# Altium project 12-5.PrjPcb
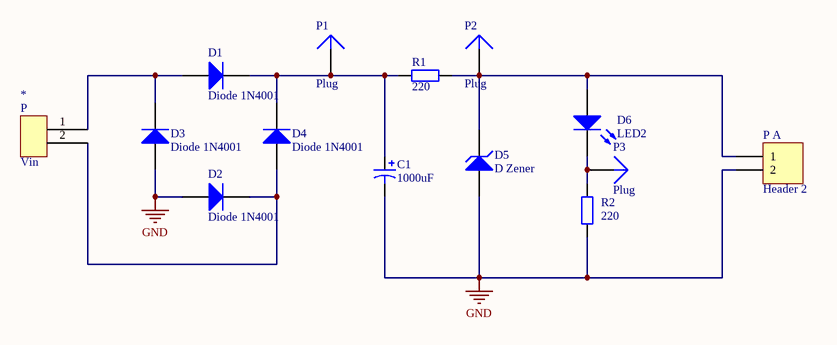
[diagram p0: 12to5.SchDoc]
1 sheet, 14 parts. Net scope: global (net labels, ports and power ports of the same name join across sheets).
Board file: 12to5IR.PcbDoc

## Sheet 12to5.SchDoc
size A; SheetNumber: 1; SheetTotal: 1; SPICEModelCacheKKYJQCPS: <root> / <DocumentId>KKYJQCPS</DocumentId> / <CacheFrame Number="0"> / <Model Name="1n4001" Kind="MDL"> / <Text>*1N4001 MCE 8-16-95 / *50V 1A Si GenPurpose Diode pkg:DIODE0.4 1,2 / .MODEL 1N4001 D(IS=2.55E-9 RS=0.042 N=1.75 TT=5.76E-6 CJO=1.85E-11 / + VJ=0.75 M=0.333 BV=50 IBV=1E-5 )</Text> / </Model> / <Model Name="led2" Kind="MDL"> / <Text>*Typ RED,GREEN,YELLOW,AMBER GaAs LED: Vf=2.1V Vr=4V If=40mA trr=3uS / *LED Pinout: 1=A, 2=K / .MODEL LED2 D (IS=93.1P RS=42M N=4.61 BV=4 IBV=10U / + CJO=2.97P VJ=.75 M=.333 TT=4.32U)</Text> / </Model> / <Model Name="zener" Kind="MDL"> / <Text>*ZENER / *Default Zener 10V @ 10mA / *Zener Diode Pinout: A,K / .MODEL ZENER D( BV=10 IBV=10E-3 )</Text> / </Model> / </CacheFrame> / </root>

### Parts
*  Vin  [PCBComponent_1]
C1  value 1000uF  [RB7.6-15]  (hidden comment: Cap Pol1)
D1  Diode 1N4001  [DO-41]
D2  Diode 1N4001  [DO-41]
D3  Diode 1N4001  [DO-41]
D4  Diode 1N4001  [DO-41]
D5  D Zener  [DIODE-0.7]
D6  LED2  [3.2X1.6X1.1]
P1  Plug  [PIN1]
P2  Plug  [PIN1]
P3  Plug  [PIN1]
P_A  Header 2  [HDR1X2]
R1  value 220  [AXIAL-0.4]  (hidden comment: Res2)
R2  value 220  [AXIAL-0.4]  (hidden comment: Res2)

### Nets
GND: C1.2 D2.1(A) D3.1(A) D5.1(A) P_A.2 R2.1
Net*_1: *.1 D1.1(A) D3.2(K)
Net*_2: *.2 D2.2(K) D4.1(A)
NetC1_1: C1.1 D1.2(K) D4.2(K) P1.1 R1.1
NetD5_2: D5.2(K) D6.1(A) P2.1 P_A.1 R1.2
NetD6_2: D6.2(K) P3.1 R2.2

### Notes on the sheet
- (in symbol CMP-041-000000-1) P

### Library data of the parts
* = CMP-041-000000-1: Source: HeaderCustom0_5.SchLib; Design Item ID: Component_1
C1 = CMP-001-00085-1: Polarized Capacitor (Radial); Signal Integrity: Cap Pol; LatestRevisionDate: 17-Jul-2002; Design Item ID: Cap Pol1; Component Type: Standard; LatestRevisionNote: Re-released for DXP Platform.; Source: Miscellaneous Devices.SchLib; Publisher: Altium Limited; Pins: 2; PackageReference: RB7.6-15; Published: 8-Jun-2000; Case/Package: Polarized Capacitor (Radial); 2 Leads
D1-D4 = CMP-004-00044-1: 1 Amp General Purpose Rectifier; Publisher: Altium Limited; Published: 8-Jun-2000; ComponentLink1URL: http://www.fairchildsemi.com/; DatasheetVersion: 1998; ComponentLink2URL: http://www.fairchildsemi.com/ds/1N%2F1N4001.pdf; PackageReference: DO-41; Pins: 2; ComponentLink2Description: Datasheet; LatestRevisionDate: 17-Jul-2002; Design Item ID: Diode 1N4001; LatestRevisionNote: Re-released for DXP Platform.; Case/Package: Diode, Axial; Body 5.2 x 2.7 mm (LxDia. max), Lead Dia. 0.86 mm (max); Component Type: Standard; PackageVersion: Aug-1999; ComponentLink1Description: Manufacturer Link; Code_JEDEC: DO-204-AL; Source: Miscellaneous Devices.SchLib; Signal Integrity: 1N4001
D5 = CMP-004-00037-1: Zener Diode; PackageReference: DIODE-0.7; LatestRevisionDate: 17-Jul-2002; LatestRevisionNote: Re-released for DXP Platform.; Component Type: Standard; Pins: 2; Case/Package: Diode, Thru-Hole; 2 Leads; 0.7 in Pin Spacing; Source: Miscellaneous Devices.SchLib; Signal Integrity: D Zener; Published: 8-Jun-2000; Design Item ID: D Zener; Publisher: Altium Limited
D6 = CMP-004-00074-1: Typical RED, GREEN, YELLOW, AMBER GaAs LED; Publisher: Altium Limited; PackageVersion: Feb-2002; Component Type: Standard; Case/Package: SM LED; 2 Flat Leads; LatestRevisionDate: 17-Jul-2002; Design Item ID: LED2; Source: Miscellaneous Devices.SchLib; PackageReference: 3.2X1.6X1.1; Pins: 2; LatestRevisionNote: Re-released for DXP Platform.; Published: 8-Jun-2000
P1-P3 = CMP-022-000003-1: Signal Integrity: Connector; LatestRevisionDate: 17-Jul-2002; Publisher: Altium Limited; Source: Miscellaneous Connectors.SchLib; Pin Count: 1; Design Item ID: Plug; LatestRevisionNote: Re-released for DXP Platform.; Component Type: Standard
P_A = CMP-002-00141-1: Header, 2-Pin; Signal Integrity: Connector; LatestRevisionDate: 17-Jul-2002; Component Type: Standard; Publisher: Altium Limited; LatestRevisionNote: Re-released for DXP Platform.; Pins: 2; Design Item ID: Header 2; Source: Miscellaneous Connectors.SchLib
R1 R2 = CMP-009-00190-1: Resistor; Signal Integrity: Res; Published: 8-Jun-2000; Case/Package: Axial Device, Thru-Hole; 2 Leads; 0.4 in Pin Spacing; Publisher: Altium Limited; LatestRevisionDate: 17-Jul-2002; Source: Miscellaneous Devices.SchLib; Pins: 2; LatestRevisionNote: Re-released for DXP Platform.; PackageReference: AXIAL-0.4; Component Type: Standard; Design Item ID: Res2